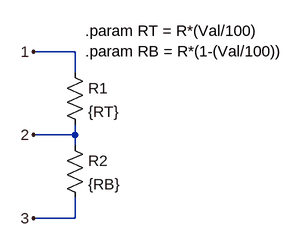
[diagram p0: schematic potenciometer.asc]
potenciometer.asc, the LTspice schematic file:
Version 4
SHEET 1 880 680
WIRE 176 64 112 64
WIRE 176 96 176 64
WIRE 176 192 176 176
WIRE 176 192 112 192
WIRE 176 208 176 192
WIRE 176 320 176 288
WIRE 176 320 112 320
FLAG 112 64 1
FLAG 112 192 2
FLAG 112 320 3
SYMBOL res 160 80 R0
SYMATTR InstName R1
SYMATTR Value {RT}
SYMBOL res 160 192 R0
SYMATTR InstName R2
SYMATTR Value {RB}
TEXT 192 32 Left 2 !.param RT = R*(Val/100)\n.param RB = R*(1-(Val/100))

The netlist it stands for:
* potenciometer.asc
R1 1 2 {RT}
R2 2 3 {RB}
.param RT = R*(Val/100)
.param RB = R*(1-(Val/100))
.backanno
.end